# EAGLE design Wobblebot_Teensy_reroutPWR (EAGLE 9.6.2)
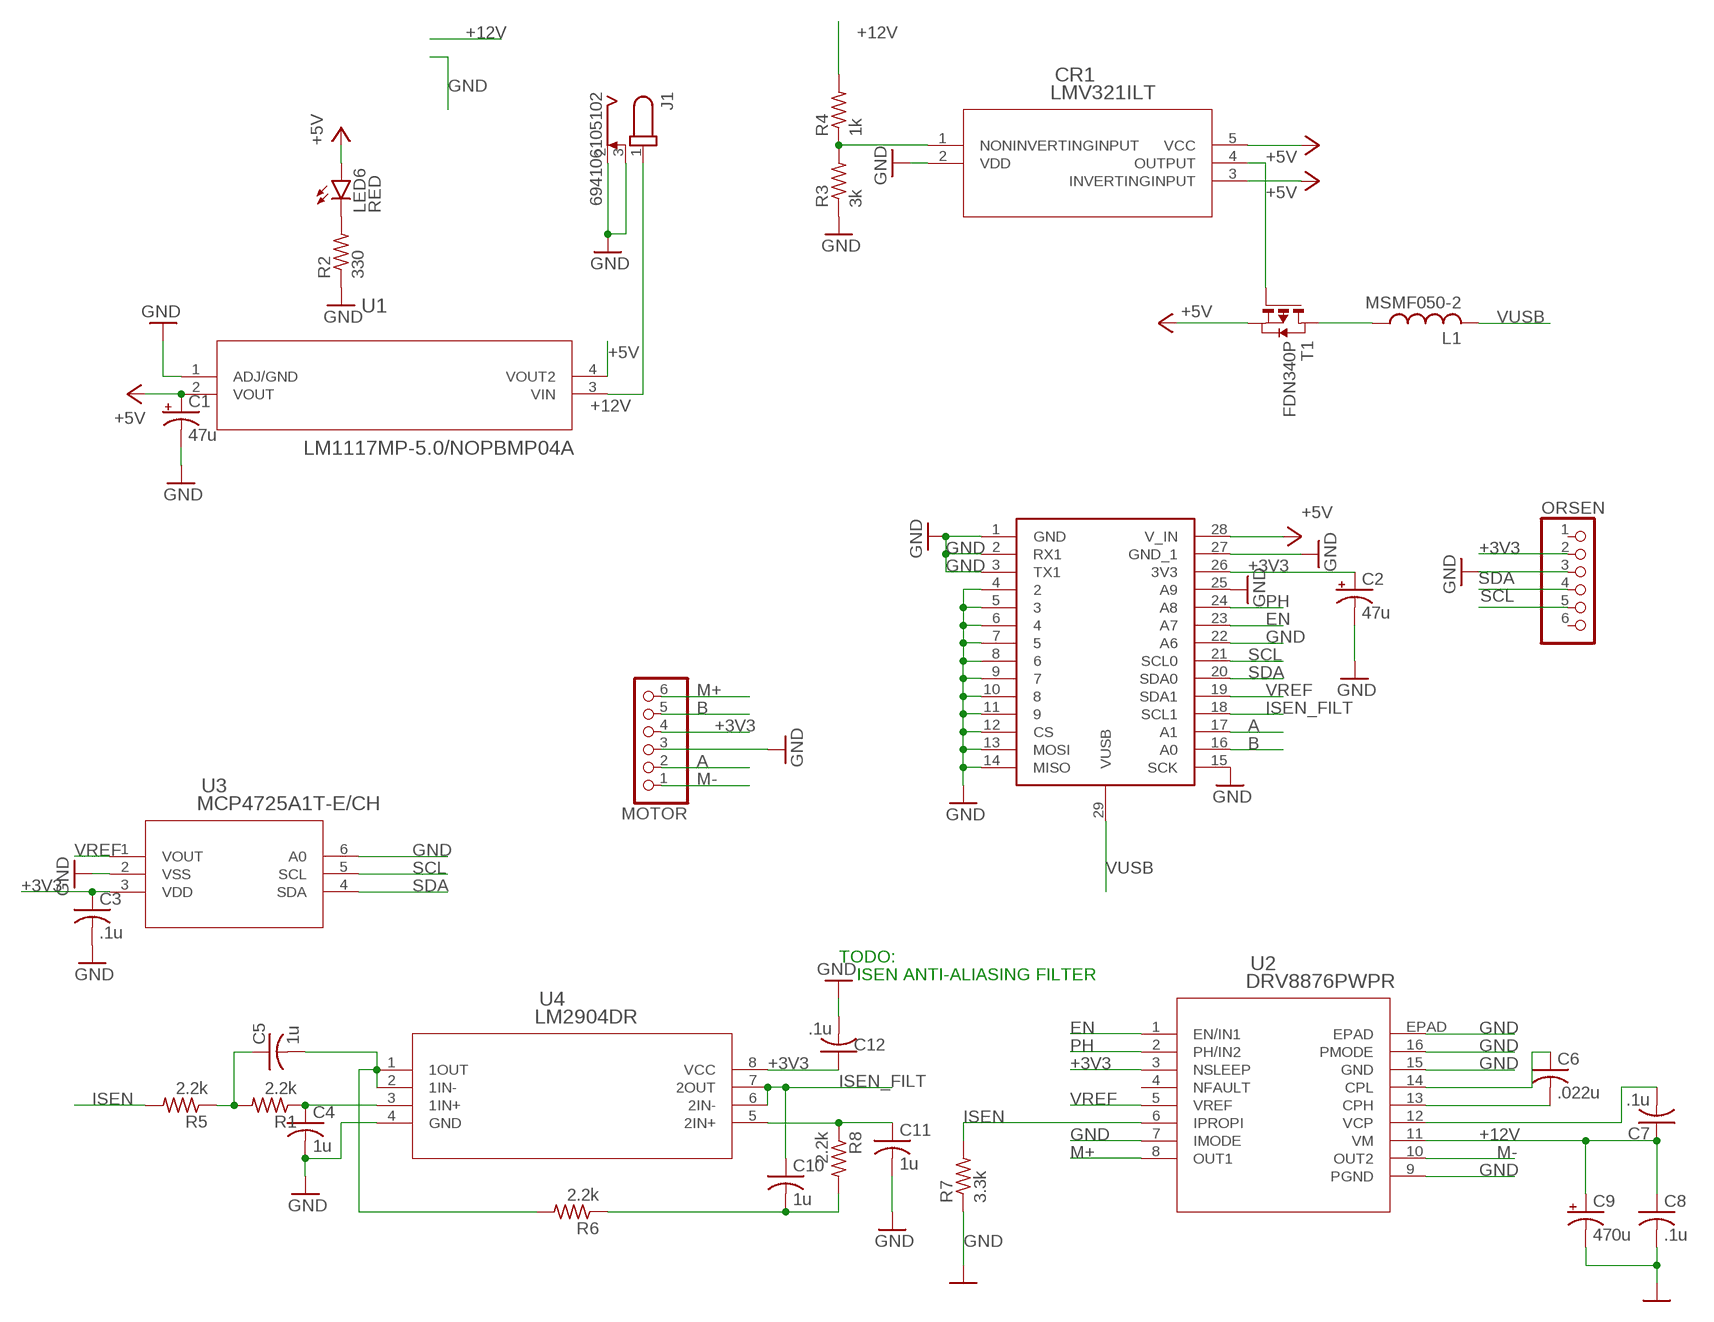
[diagram p0: schematic, sheet 1]

## Parts
C1  47u  CPOL-US153CLV-0605  [153CLV-0605]
C2  47u  CPOL-US153CLV-0605  [153CLV-0605]
C3  .1u  C-USC0805  [C0805]
C4  1u  C-USC0805  [C0805]
C5  1u  C-USC0805  [C0805]
C6  .022u  C-USC0805  [C0805]
C7  .1u  C-USC0805  [C0805]
C8  .1u  C-USC0805  [C0805]
C9  470u  CPOL-USE5-10.5  [E5-10,5]
C10  1u  C-USC0805  [C0805]
C11  1u  C-USC0805  [C0805]
C12  .1u  C-USC0805  [C0805]
CR1  LMV321ILT  [SOT23-5]
J1  694106105102  [694106105102]
L1  MSMF050-2  L-USL1812  [L1812]
LED6  RED  LEDCHIPLED_0805  [CHIPLED_0805]
MOTOR  PINHD-1X6  [1X06]
ORSEN  PINHD-1X6  [1X06]
R1  2.2k  R-US_R0805  [R0805]
R2  330  R-US_R0805  [R0805]
R3  3k  R-US_R0805  [R0805]
R4  1k  R-US_R0805  [R0805]
R5  2.2k  R-US_R0805  [R0805]
R6  2.2k  R-US_R0805  [R0805]
R7  3.3k  R-US_R0805  [R0805]
R8  2.2k  R-US_R0805  [R0805]
T1  FDN340P  PMOSSOT23  [SOT-23]
U1  LM1117MP-5.0/NOPBMP04A  [MP04A]
U2  DRV8876PWPR  [PWP16_2P31X2P46]
U3  MCP4725A1T-E/CH  [SOT-23-6_MC]
U4  LM2904DR  [D8]
U$1  TEENSY4.0TEENSY4.0  [DIP1524W53P254L3810H508Q28B]

## Nets
+3V3: C2.+ C3.1 C12.1 MOTOR.4 ORSEN.2 U2.3(NSLEEP) U3.3(VDD) U4.8(VCC) U$1.26(3V3)
+5V: C1.+ CR1.3(INVERTINGINPUT) CR1.5(VCC) LED6.A T1.2(S) U1.2(VOUT) U1.4(VOUT2) U$1.28(V_IN)
+12V: C7.1 C8.1 C9.+ J1.1 R4.2 U1.3(VIN) U2.11(VM)
A: MOTOR.2 U$1.17(A1)
B: MOTOR.5 U$1.16(A0)
EN: U2.1(EN/IN1) U$1.23(A7)
GND: C1.- C2.- C3.2 C4.2 C8.2 C9.- C11.2 C12.2 CR1.2(VDD) J1.2 J1.3 MOTOR.3 ORSEN.3 R2.1 R3.1 R7.1 U1.1(ADJ/GND) U2.7(IMODE) U2.9(PGND) U2.15(GND) U2.16(PMODE) U2.EPAD U3.2(VSS) U3.6(A0) U4.4(GND) U$1.1(GND) U$1.2(RX1) U$1.3(TX1) U$1.4 U$1.5 U$1.6 U$1.7 U$1.8 U$1.9 U$1.10 U$1.11 U$1.12(CS) U$1.13(MOSI) U$1.14(MISO) U$1.15(SCK) U$1.22(A6) U$1.25(A9) U$1.27(GND_1)
ISEN: R5.2 R7.2 U2.6(IPROPI)
ISEN_FILT: C10.1 U4.6(2IN-) U4.7(2OUT) U$1.18(SCL1)
M+: MOTOR.6 U2.8(OUT1)
M-: MOTOR.1 U2.10(OUT2)
N$1: C5.2 R6.2 U4.1(1OUT) U4.2(1IN-)
N$3: CR1.1(NONINVERTINGINPUT) R3.2 R4.1
N$5: LED6.C R2.2
N$6: CR1.4(OUTPUT) T1.3(G)
N$7: C11.1 R8.1 U4.5(2IN+)
N$8: C10.2 R6.1 R8.2
N$9: C5.1 R1.2 R5.1
N$10: C4.1 R1.1 U4.3(1IN+)
N$17: C6.1 U2.14(CPL)
N$18: C6.2 U2.13(CPH)
N$19: C7.2 U2.12(VCP)
PH: U2.2(PH/IN2) U$1.24(A8)
SCL: ORSEN.5 U3.5(SCL) U$1.21(SCL0)
SDA: ORSEN.4 U3.4(SDA) U$1.20(SDA0)
USBVCC: L1.1 T1.1(D)
VREF: U2.5(VREF) U3.1(VOUT) U$1.19(SDA1)
VUSB: L1.2 U$1.29(VUSB)
Unconnected: ORSEN.1 ORSEN.6 U2.4(NFAULT)

## Notes on the sheet
- TODO:
- ISEN ANTI-ALIASING FILTER

## Library data of the parts
C1 C2 C9 = rcl:CPOL-US: POLARIZED CAPACITOR, American symbol; SPICEPREFIX: C
C3-C8 C10-C12 = rcl:C-US: CAPACITOR, American symbol; SPICEPREFIX: C
CR1 = wobbleBot:LMV321ILT; MANUFACTURER_PART_NUMBER: LMV321ILT; VENDOR: STMicroelectronics
J1 = DC Power Jacks:694106105102: CONN PWR JACK 2.05X5.5MM SOLDER Manufacturer's datasheet <https://katalog.we-online.de/em/datasheet/6941xx105102.pdf>; CREATED_BY: PCBLayout.com; DIGIKEY_PART_NUMBER: 732-5928-2-ND; MANUFACTURER: Wurth Electronics Inc.; MPN: 694106105102
L1 = rcl:L-US: INDUCTOR, American symbol; SPICEPREFIX: L
LED6 = led:LED: LED OSRAM: - CHIPLED LG R971, LG N971, LY N971, LG Q971, LY Q971, LO R971, LY R971 LH N974, LH R974 LS Q976, LO Q976, LY Q976 LO Q996 - Hyper CHIPLED LW Q18S LB Q993, LB Q99A, LB R99A - SideLED LS A670, LO A670, LY A670, LG A670, LP A670 LB A673, LV A673, LT A673, LW A673 LH A674 LY A675 LS A676, LA A676, LO A676, LY A676, LW A676 LS A679, LY A679, LG A679 - Hyper Micro SIDELED® LS Y876, LA Y876, LO Y876, LY Y876 LT Y87S - SmartLED LW L88C, LW L88S LB L89C, LB L89S, LG L890 LS L89K, LO L89K, LY L89K LS L896, LA L896, LO L896, LY L896 - TOPLED LS T670, LO T670, LY T670, LG T670, LP T670 LSG T670, LSP T670, LSY T670, LOP T670, LYG T670 LG T671, LOG T671, LSG T671 LB T673, LV T673, LT T673, LW T673 LH T674 LS T676, LA T676, LO T676, LY T676, LB T676, LH T676, LSB T676, LW T676 LB T67C, LV T67C, LT T67C, LS T67K, LO T67K, LY T67K, LW E67C LS E67B, LA E67B, LO E67B, LY E67B, LB E67C, LV E67C, LT E67C LW T67C LS T679, LY T679, LG T679 LS T770, LO T770, LY T770, LG T770, LP T770 LB T773, LV T773, LT T773, LW T773 LH T774 LS E675, LA E675, LY E675, LS T675 LS T776, LA T776, LO T776, LY T776, LB T776 LHGB T686 LT T68C, LB T68C - Hyper Mini TOPLED® LB M676 - Mini TOPLED Santana® LG M470 LS M47K, LO M47K, LY M47K Source: http://www.osram.convergy.de LUXEON: - LUMILED® LXK2-PW12-R00, LXK2-PW12-S00, LXK2-PW14-U00, LXK2-PW14-V00 LXK2-PM12-R00, LXK2-PM12-S00, LXK2-PM14-U00 LXK2-PE12-Q00, LXK2-PE12-R00, LXK2-PE12-S00, LXK2-PE14-T00, LXK2-PE14-U00 LXK2-PB12-K00, LXK2-PB12-L00, LXK2-PB12-M00, LXK2-PB14-N00, LXK2-PB14-P00, LXK2-PB14-Q00 LXK2-PR12-L00, LXK2-PR12-M00, LXK2-PR14-Q00, LXK2-PR14-R00 LXK2-PD12-Q00, LXK2-PD12-R00, LXK2-PD12-S00 LXK2-PH12-R00, LXK2-PH12-S00 LXK2-PL12-P00, LXK2-PL12-Q00, LXK2-PL12-R00 Source: www.luxeon.com KINGBRIGHT: KA-3528ASYC Source: www.kingbright.com
MOTOR ORSEN = pinhead:PINHD-1X6: PIN HEADER
R1-R8 = rcl:R-US_: RESISTOR, American symbol; SPICEPREFIX: R
T1 = zetex:PMOSSOT23: MOS FET; OC_FARNELL: unknown; OC_NEWARK: unknown
U1 = wobbleBot:LM1117MP-5.0/NOPB; MANUFACTURER_PART_NUMBER: LM1117MP5.0NOPB; VENDOR: Texas Instruments
U2 = wobbleBot:DRV8876PWPR; BUILT_BY: EMA_Molly; COPYRIGHT: Copyright (C) 2018 Accelerated Designs. All rights reserved; MANUFACTURER_PART_NUMBER: DRV8876PWPR; VENDOR: Texas Instruments
U3 = wobbleBot:MCP4725A1T-E/CH; BUILT_BY: EMA_Jessica; COPYRIGHT: Copyright (C) 2018 Accelerated Designs. All rights reserved; MANUFACTURER_PART_NUMBER: MCP4725A1T-E/CH; VENDOR: Microchip
U4 = wobbleBot:LM2904DR; MANUFACTURER_PART_NUMBER: LM2904DR; VENDOR: Vendor
U$1 = wobbleBot:TEENSY4.0

## Board
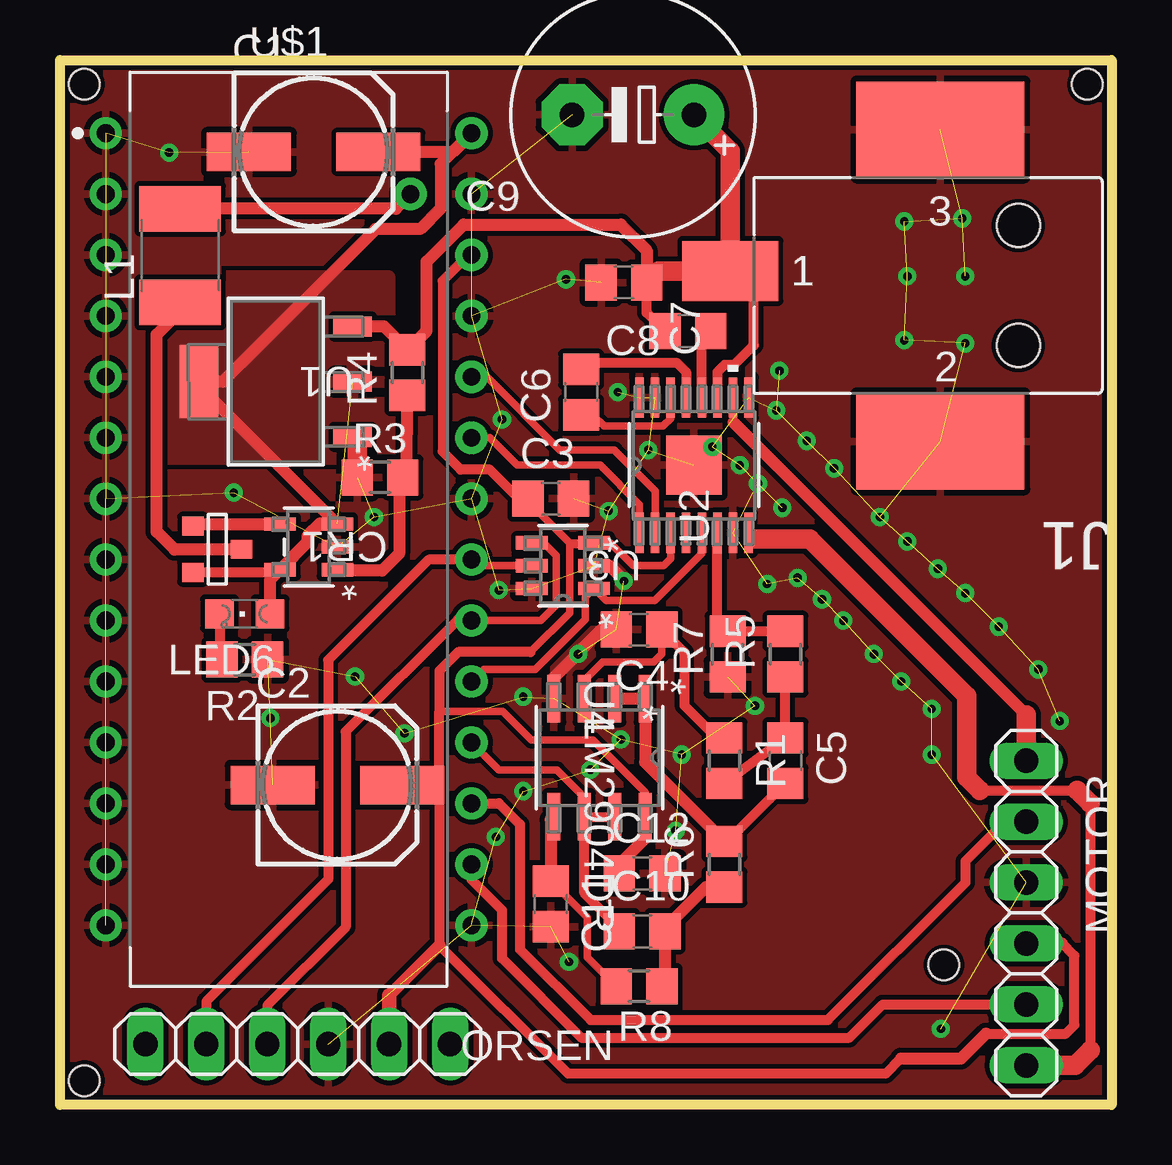
[diagram p1: board, top side]
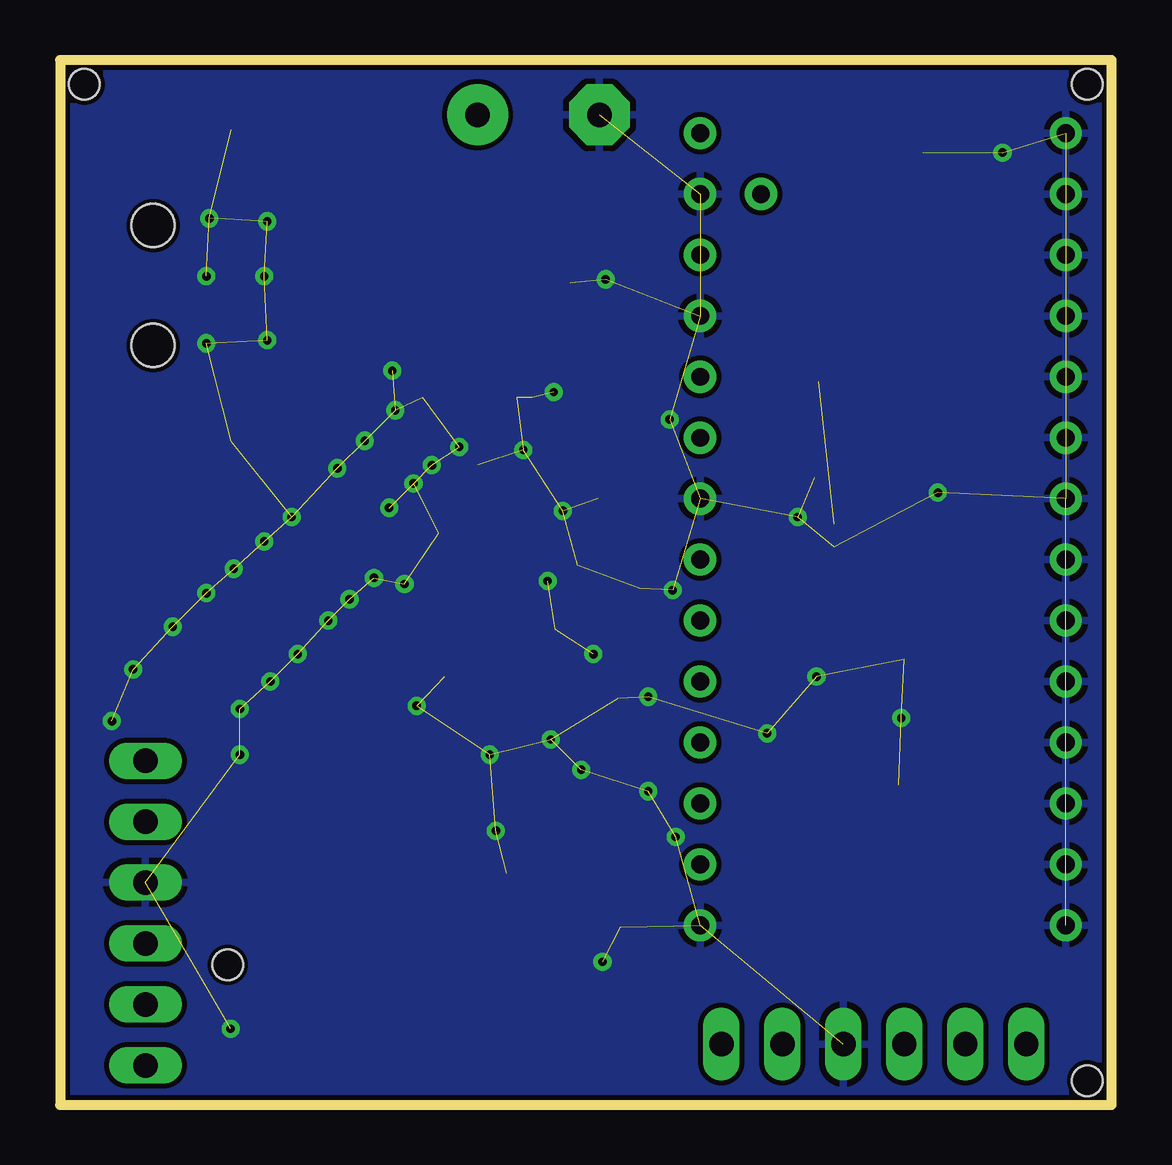
[diagram p2: board, bottom side, seen from below]

Size 43.81 x 43.56 mm. Coordinates in mm from the lower left corner, seen from the top.
Outline: 0,0 0,43.56 43.81,43.56 43.81,0 0,0
Copper layers (1*16): Top 0.035mm / dielectric 1.5mm / Bottom 0.035mm
Design rules "PCBway *": minimum track width 6mil, minimum drill 0.3mm, track to track 0.205mm, track to pad 0.205mm, pad to pad 0.205mm, via to via 0.205mm, smd to smd 8mil, copper to edge 8mil, drill to drill 8mil, minimum pad ring 10mil, minimum via ring 8mil, stop-mask expansion 4mil, vias tented up to drill 25mil, thermal gap 10mil
Holes 1.27 mm at 1.02,1.02 1.02,42.55 42.8,42.55 36.83,5.84

### Footprints (pad centres in the part's own frame; a part is rotated, then mirrored left to right if it is on the bottom)
153CLV-0605 = smd 3.5 x 1.6: + 2.7,0; - -2.7,0
C0805 = smd 1.3 x 1.5: 1 -0.95,0; 2 0.95,0
E5-10,5 = drill 1.016 pad 2.54: + -2.54,0 | drill 1.016 pad 2.54 octagon: - 2.54,0
SOT23-5 = smd 1.321 x 0.559: 1 -1.194,0.95; 2 -1.194,0; 3 -1.194,-0.95; 4 1.194,-0.95; 5 1.194,0.95
694106105102 = smd 4 x 2.5: 1 15.5,-0.6 | smd 7 x 4: 2 6.75,6.5; 3 6.75,-6.5 | hole 1.8: 3.5,2.5; 3.5,-2.5
L1812 = smd 1.9 x 3.4: 1 -1.95,0; 2 1.95,0
CHIPLED_0805 = smd 1.2 x 1.2: A 0,-1.05; C 0,1.05
1X06 = drill 1.016 long: 1 -6.35,0; 2 -3.81,0; 3 -1.27,0; 4 1.27,0; 5 3.81,0; 6 6.35,0
R0805 = smd 1.3 x 1.5: 1 -0.95,0; 2 0.95,0
SOT-23 = smd 0.787 x 0.889: 1 0.025,-1.016; 2 -0.94,1.016; 3 0.991,1.016
MP04A = smd 1.6 x 0.838: 1 -3.2,2.3; 2 -3.2,0; 3 -3.2,-2.3 | smd 1.6 x 3.048: 4 3.2,0
PWP16_2P31X2P46 = smd 1.676 x 0.356: 1 -2.819,2.275; 2 -2.819,1.625; 3 -2.819,0.975; 4 -2.819,0.325; 5 -2.819,-0.325; 6 -2.819,-0.975; 7 -2.819,-1.625; 8 -2.819,-2.275; 9 2.819,-2.275; 10 2.819,-1.625; 11 2.819,-0.975; 12 2.819,-0.325; 13 2.819,0.325; 14 2.819,0.975; 15 2.819,1.625; 16 2.819,2.275 | smd 2.46 x 2.31: EPAD 0,0
SOT-23-6_MC = smd 1.321 x 0.559: 1 -1.295,0.95; 2 -1.295,0; 3 -1.295,-0.95; 4 1.295,-0.95; 5 1.295,0; 6 1.295,0.95
D8 = smd 1.981 x 0.559: 1 -2.464,1.905; 2 -2.464,0.635; 3 -2.464,-0.635; 4 -2.464,-1.905; 5 2.464,-1.905; 6 2.464,-0.635; 7 2.464,0.635; 8 2.464,1.905
DIP1524W53P254L3810H508Q28B = drill 0.743 pad 1.343: 1 -7.62,16.51; 2 -7.62,13.97; 3 -7.62,11.43; 4 -7.62,8.89; 5 -7.62,6.35; 6 -7.62,3.81; 7 -7.62,1.27; 8 -7.62,-1.27; 9 -7.62,-3.81; 10 -7.62,-6.35; 11 -7.62,-8.89; 12 -7.62,-11.43; 13 -7.62,-13.97; 14 -7.62,-16.51; 15 7.62,-16.51; 16 7.62,-13.97; 17 7.62,-11.43; 18 7.62,-8.89; 19 7.62,-6.35; 20 7.62,-3.81; 21 7.62,-1.27; 22 7.62,1.27; 23 7.62,3.81; 24 7.62,6.35; 25 7.62,8.89; 26 7.62,11.43; 27 7.62,13.97; 28 7.62,16.51; 29 5.08,13.97

### Placement (x,y rotation side)
C1  10.57,39.73 0 top
C2  11.56,13.34 0 top
C3  20.45,25.27 0 top
C4  24.13,19.81 180 top
C5  30.23,14.35 270 top
C6  21.72,29.72 90 top
C7  26.16,32.26 0 top
C8  23.5,34.29 180 top
C9  23.88,41.27 180 top
C10  24.26,7.24 0 top
C11  20.45,8.38 270 top
C12  24.26,9.65 0 top
CR1  10.36,23.27 180 top
J1  43.43,34.16 180 top
L1  5,35.41 90 top
LED6  7.7,20.47 90 top
MOTOR  40.26,8 270 top
ORSEN  9.91,2.54 180 top
R1  27.69,14.35 270 top
R2  7.7,18.57 180 top
R3  13.34,26.16 0 top
R4  14.48,30.53 90 top
R5  30.23,18.8 90 top
R6  27.69,10.03 90 top
R7  27.81,18.8 90 top
R8  24.13,4.95 0 top
T1  6.55,23.14 90 top
U1  8.99,30.15 180 top
U2  26.42,26.67 90 top
U3  20.95,22.48 180 top
U4  22.48,14.48 270 top
U$1  9.53,24 0 top

### Tracks (layer width: path | path; a pad name or v marks a point on that pad's centre or on a via)
+3V3
  Top 0.305: C3.1 19.5,25.17 21.23,23.43 U3.3 | U3.3 22.93,23.43 23.88,22.48 25.15,22.48 25.44,22.77 U2.3 | U4.8 24.39,13.03 22.2,15.21 19.64,15.21 18.44,16.41 15.81,16.41 | U3.3 22.19,23.37 21.23,23.37 21.23,20.51 19.6,18.88
  Top 0.406: 15.81,13.34 15.81,6.67 21.17,1.3 34.4,1.3 35.04,1.94 | 15.81,13.34 15.81,16.41 15.81,18.1 16.59,18.88 19.6,18.88 | C2.+ 15.81,13.34 | U$1.26 17.02,35.43 15.94,34.35 15.94,27.24 16.7,26.48 17.91,26.48 19.12,25.27 C3.1 | 38.58,2.97 41.91,2.97 42.27,3.33 42.27,6.22 41.76,6.73
  Top 0.508: C12.1 23.31,10.03 24.38,11.11 U4.8 | 35.04,1.94 37.55,1.94 38.58,2.97 | 41.76,6.73 MOTOR.4 | 15.81,6.67 13.72,4.57
  Top 0.61: 13.72,4.57 ORSEN.2
+5V  (1 unrouted)
  Top 0.406: CR1.5 9.05,22.2 T1.2
  Top 0.508: LED6.A 8.75,21.89 CR1.5 10.31,23.46 10.31,23.71 10.86,24.26 11.52,24.26 CR1.3 5.79,29.98 U1.4 6.78,30.15 13.15,36.52 15,36.52 15.86,37.38 15.86,39.23 U$1.28 16.36,39.73 C1.+
  pour Top: 13.72,26.92 3.3,26.92 3.3,34.54 13.72,34.54
+12V
  Top 0.406: U2.11 27.39,30.56 27.69,30.86 28.1,30.86 28.91,31.67 28.91,33.79 J1.1 | C7.1 24.45,33.02 C8.1
  Top 0.508: U1.3 13.51,32.45 R4.2 15.28,32.28 15.28,35.16 16.82,36.7 23.37,36.7 24.45,35.63 C8.1
  Top 0.813: C8.1 24.92,34.76 J1.1 27.93,39.76 C9.+
A
  Top 0.406: MOTOR.2 39.37,11.81 37.72,10.16 37.72,9.27 32,3.54 22.11,3.54 19.16,6.49 19.16,11.7 18.29,12.57 U$1.17
B
  Top 0.406: U$1.16 17.14,9.4 18.42,8.12 18.42,6.11 21.73,2.8 32.89,2.8 34.28,4.19 MOTOR.5
EN
  Top 0.305: U2.1 24.14,25.03 22.5,26.67 19.05,26.67 17.91,27.81 U$1.23
GND  (via drill 0.35)  (91 unrouted)
  Top 0.406: C4.2 22.55,19.81 | U4.4 20.57,17.83 | v27.18,27.43 U2.EPAD
  Top 0.508: 22.55,19.81 20.57,17.83 | v23.5,21.84 23.37,21.97 23.37,22 22.89,22.48 U3.2
  Top 0.813: R3.1 12.38,27.66 U1.1
  other vias: 22.86,24.77 21.21,5.97 18.29,21.46 25.65,11.43 24.51,27.3 28.96,16.64 29.97,30.61 35.18,36.83 37.59,36.96 37.72,34.54 35.31,34.54 35.18,31.88 37.72,31.75 12.29,17.86 21.08,34.42 8.76,16.13 22.1,13.97 19.3,13.08 23.24,29.72 14.35,15.49 36.7,3.17 23.37,15.24 28.32,26.67 29.08,25.91 30.1,24.89 29.84,28.96 31.11,27.69 32.26,26.54 34.16,24.51 35.31,23.5 36.58,22.35 37.72,21.34 39.12,19.94 40.77,18.16 41.66,16 29.46,21.72 30.73,21.97 31.75,21.08 32.64,20.19 33.91,18.8 35.05,17.65 36.32,16.51 36.32,14.61 25.91,14.61 18.41,28.57 21.59,18.8 19.3,17.02 13.08,24.51 7.24,25.53 18.16,11.18 4.55,39.7
  pour Top (rank 6): -0.76,44.7 44.83,44.7 44.83,-0.89 -0.76,-0.89
  pour Bottom (rank 6): -0.76,44.7 44.96,44.7 44.96,-0.76 -0.76,-0.76
ISEN
  Top 0.406: R5.2 R7.2 27.39,20.17 U2.6
ISEN_FILT
  Top 0.305: U4.6 21.84,12.83 20.7,13.97 18.29,13.97 U$1.18
  Top 0.406: U4.7 U4.6 21.84,8.83 23.31,7.37
  Top 0.508: C10.1 23.31,7.37
M+
  Top 0.305: 28.95,23.6 U2.8
  Top 0.406: 38.32,13.11 42.4,13.11 | 42.93,12.57 42.93,2.29
  Top 0.813: 28.95,23.6 31.23,23.6 37.78,17.05 37.78,13.65 38.32,13.11 | 42.93,2.29 42.3,1.65 MOTOR.6 | 42.4,13.11 42.93,12.57
M-
  Top 0.305: U2.10 28.07,29.46 28.07,28.45
  Top 0.508: 28.07,28.45 40.26,16.26
  Top 0.813: MOTOR.1 40.26,16.26
N$1
  Top 0.406: C5.2 27.81,10.98 R6.2
  Top 0.508: U4.2 U4.1 24.38,14.29 R6.2
N$3
  Top 0.508: R4.1 14.41,26.29 R3.2 14.13,26.01 14.13,22.98 13.42,22.27 11.6,22.27 CR1.1
N$5
  Top 0.406: LED6.C 6.65,18.67 R2.2
N$6
  Top 0.508: T1.3 5.62,24.22 CR1.4
N$7
  Top 0.305: R8.1 21.97,6.16 21.97,7.81 C11.1
  Top 0.508: U4.5 20.45,11.89 C11.1
N$8
  Top 0.508: R6.1 26.92,9.08 25.21,7.37 C10.2 25.21,5.08 R8.2
N$9
  Top 0.406: R1.2 C5.1 R5.1
N$10
  Top 0.305: U4.3 21.84,17.7 22.61,18.47 24.75,18.47 25.08,18.8 C4.1
  Top 0.406: C4.1 26.02,18.87 26.02,16.65 27.36,15.3 R1.1
N$17
  Top 0.305: U2.14 25.44,28.62 25.12,28.29 22.67,28.29 22.2,28.77 C6.1
N$18
  Top 0.406: U2.13 26.09,30.56 25.73,30.92 21.97,30.92 C6.2
N$19
  Top 0.406: U2.12 26.74,31.89 C7.2
PH
  Top 0.305: U2.2 24.8,23.86 24.8,25.6 23.1,27.3 20.83,27.3 17.78,30.35 U$1.24
SCL
  Top 0.305: U3.5 17.4,22.48 U$1.21
  Top 0.406: U$1.21 15.37,22.73 11.18,18.54 11.18,9.4 6.1,4.32 ORSEN.5
SDA
  Top 0.305: U3.4 19.72,23.37 20.21,23.37 20.68,22.91 20.68,20.85 20.02,20.19 U$1.20
  Top 0.406: U$1.20 16.64,20.19 16.58,20.25 11.9,15.57 11.9,7.41 8.64,4.14 ORSEN.4
USBVCC
  Top 0.508: L1.1 5,33.1 4.02,32.12 4.02,23.9 4.78,23.15 7.43,23.15 7.44,23.16 T1.1
VREF
  Top 0.305: U2.5 26.74,22.98 24.78,21.02 22.76,21.02 U3.1 21.89,21.17 21.89,20.24 19.81,18.16 17.65,18.16 U$1.19
VUSB
  Top 0.508: U$1.29 13.99,37.36 L1.2